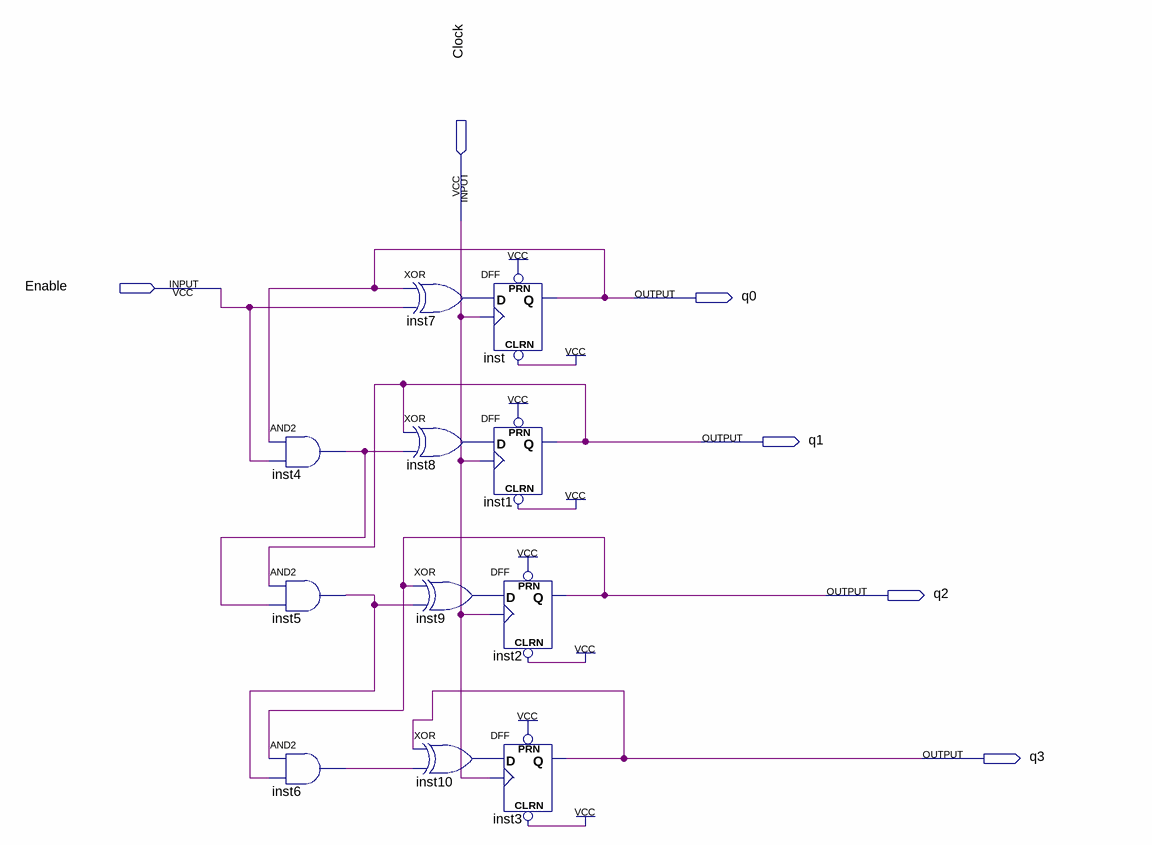
[diagram p0: schematic sheet]
// Quartus schematic lab10step2a.bdf as structural Verilog: 11 symbols, 6 pins
module lab10step2a (
  input  Clock,
  input  Enable,
  output q0,
  output q1,
  output q2,
  output q3
);

  wire inst4_out, inst5_out, inst6_out, inst7_out, inst8_out, inst9_out, inst10_out;

  and inst4 (inst4_out, q0, Enable);
  and inst5 (inst5_out, q1, inst4_out);
  and inst6 (inst6_out, q2, inst5_out);
  xor inst7 (inst7_out, q0, Enable);
  xor inst8 (inst8_out, q1, inst4_out);
  xor inst9 (inst9_out, q2, inst5_out);
  xor inst10 (inst10_out, q3, inst6_out);
  DFF inst (.CLRN(1'b1), .CLK(Clock), .D(inst7_out), .PRN(1'b1), .Q(q0));
  DFF inst1 (.CLRN(1'b1), .CLK(Clock), .D(inst8_out), .PRN(1'b1), .Q(q1));
  DFF inst2 (.CLRN(1'b1), .CLK(Clock), .D(inst9_out), .PRN(1'b1), .Q(q2));
  DFF inst3 (.CLRN(1'b1), .CLK(Clock), .D(inst10_out), .PRN(1'b1), .Q(q3));
endmodule
